# EAGLE design ESP01 Breakout (EAGLE 6.5.0)
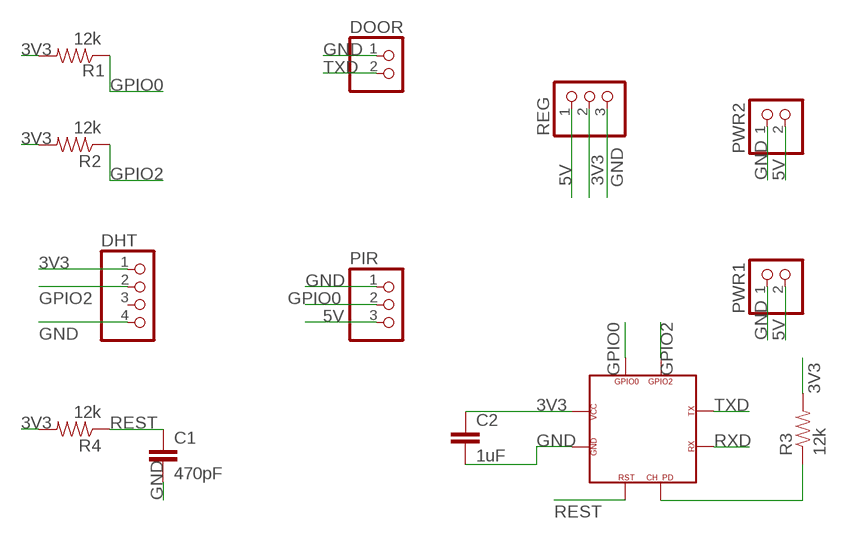
[diagram p0: schematic, sheet 1]

## Parts
C1  470pF  CAPEZ  [CAP-PTH-SMALLEZ]
C2  1uF  CAPEZ  [CAP-PTH-SMALLEZ]
DHT  PINHD-1X4  [1X04]
DOOR  PINHD-1X2/90  [1X02/90]
PIR  PINHD-1X3  [1X03]
PWR1  PINHD-1X2/90  [1X02/90]
PWR2  PINHD-1X2/90  [1X02/90]
R1  12k  RESISTORPTH-1/4W  [AXIAL-0.4]
R2  12k  RESISTORPTH-1/4W  [AXIAL-0.4]
R3  12k  RESISTORPTH-1/4W  [AXIAL-0.4]
R4  12k  RESISTORPTH-1/4W  [AXIAL-0.4]
REG  PINHD-1X3  [1X03]
U$2  ESP-01  [ESP-01]

## Nets
3V3: C2.1 DHT.1 R1.P$2 R2.P$2 R3.P$2 R4.P$2 REG.2 U$2.VCC
5V: PIR.3 PWR1.2 PWR2.2 REG.1
GND: C1.2 C2.2 DHT.4 DOOR.1 PIR.1 PWR1.1 PWR2.1 REG.3 U$2.GND
GPIO0: PIR.2 R1.P$1 U$2.GPIO0
GPIO2: DHT.2 R2.P$1 U$2.GPIO2
N$3: R3.P$1 U$2.CH_PD(CP_PD)
REST: C1.1 R4.P$1 U$2.RST
RXD: U$2.RXD(RX)
TXD: DOOR.2 U$2.TXD(TX)
Unconnected: DHT.3

## Library data of the parts
C1 C2 = SparkFun-Capacitors:CAP: Capacitor Standard 0603 ceramic capacitor, and 0.1" leaded capacitor.
DHT = pinhead:PINHD-1X4: PIN HEADER
DOOR PWR1 PWR2 = pinhead:PINHD-1X2: PIN HEADER
PIR REG = pinhead:PINHD-1X3: PIN HEADER
R1-R4 = SparkFun-Passives:RESISTOR: Resistor Basic schematic elements and footprints for 0603, 1206, and PTH resistors.
U$2 = Franc:ESP-01

## Board
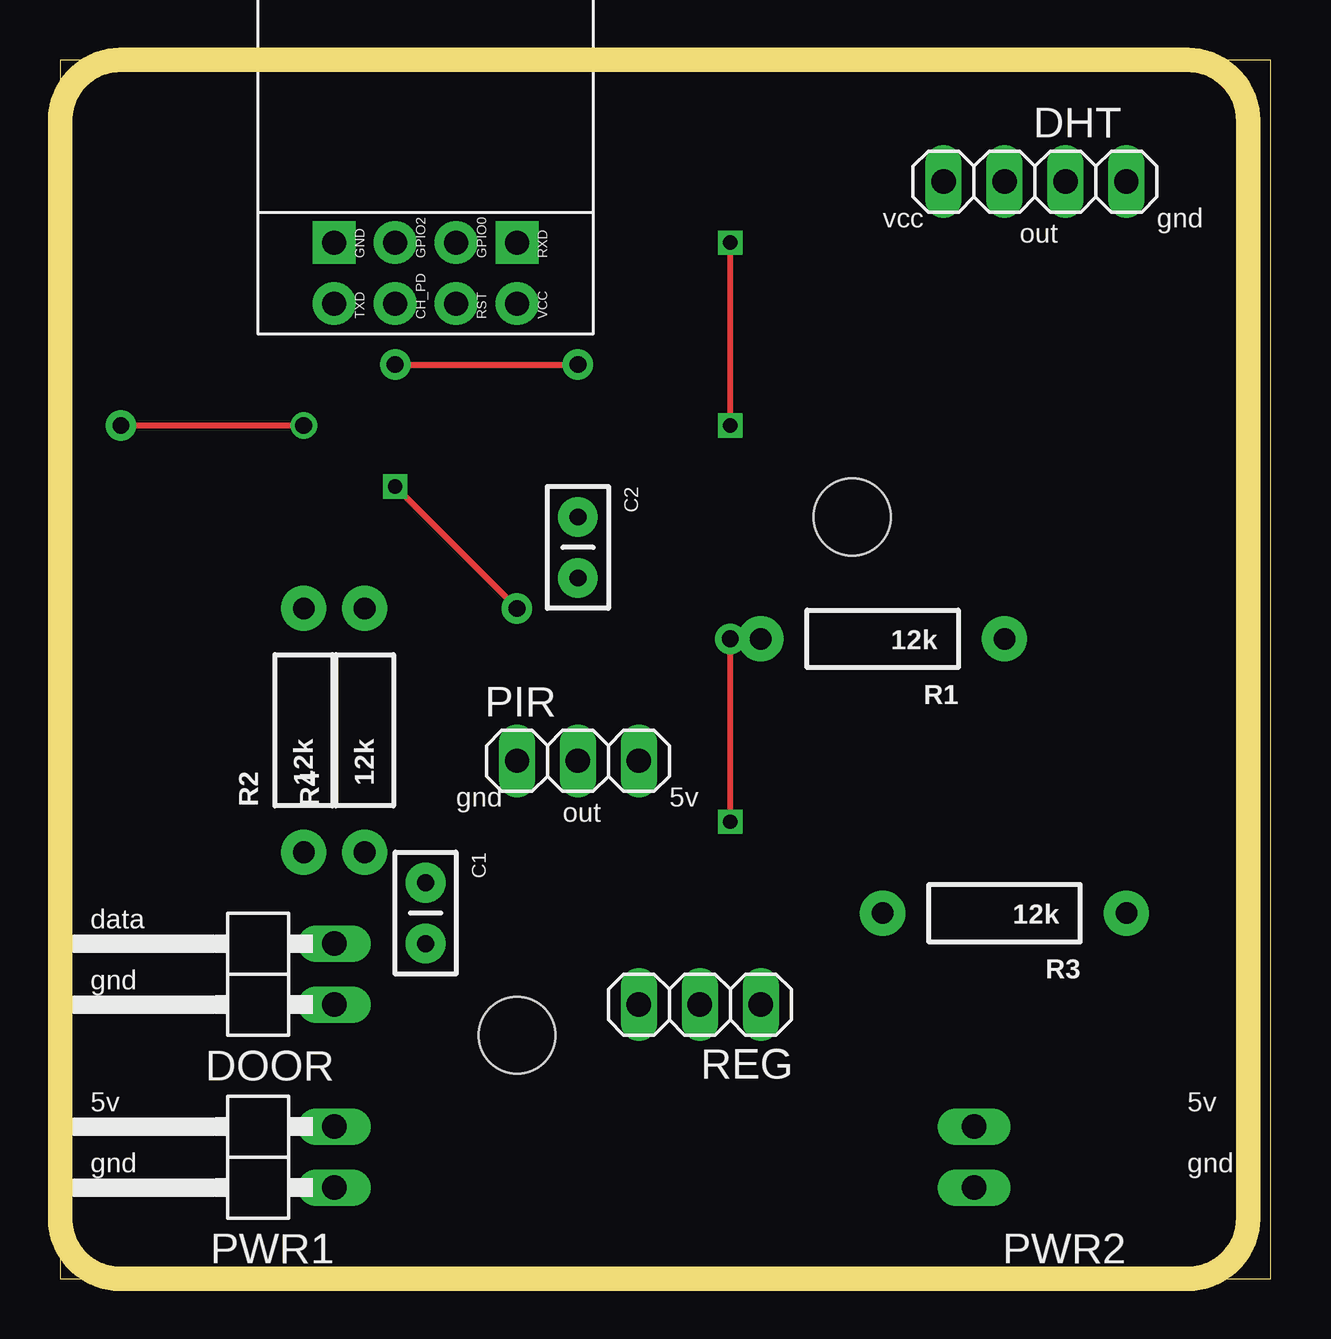
[diagram p1: board, top side]
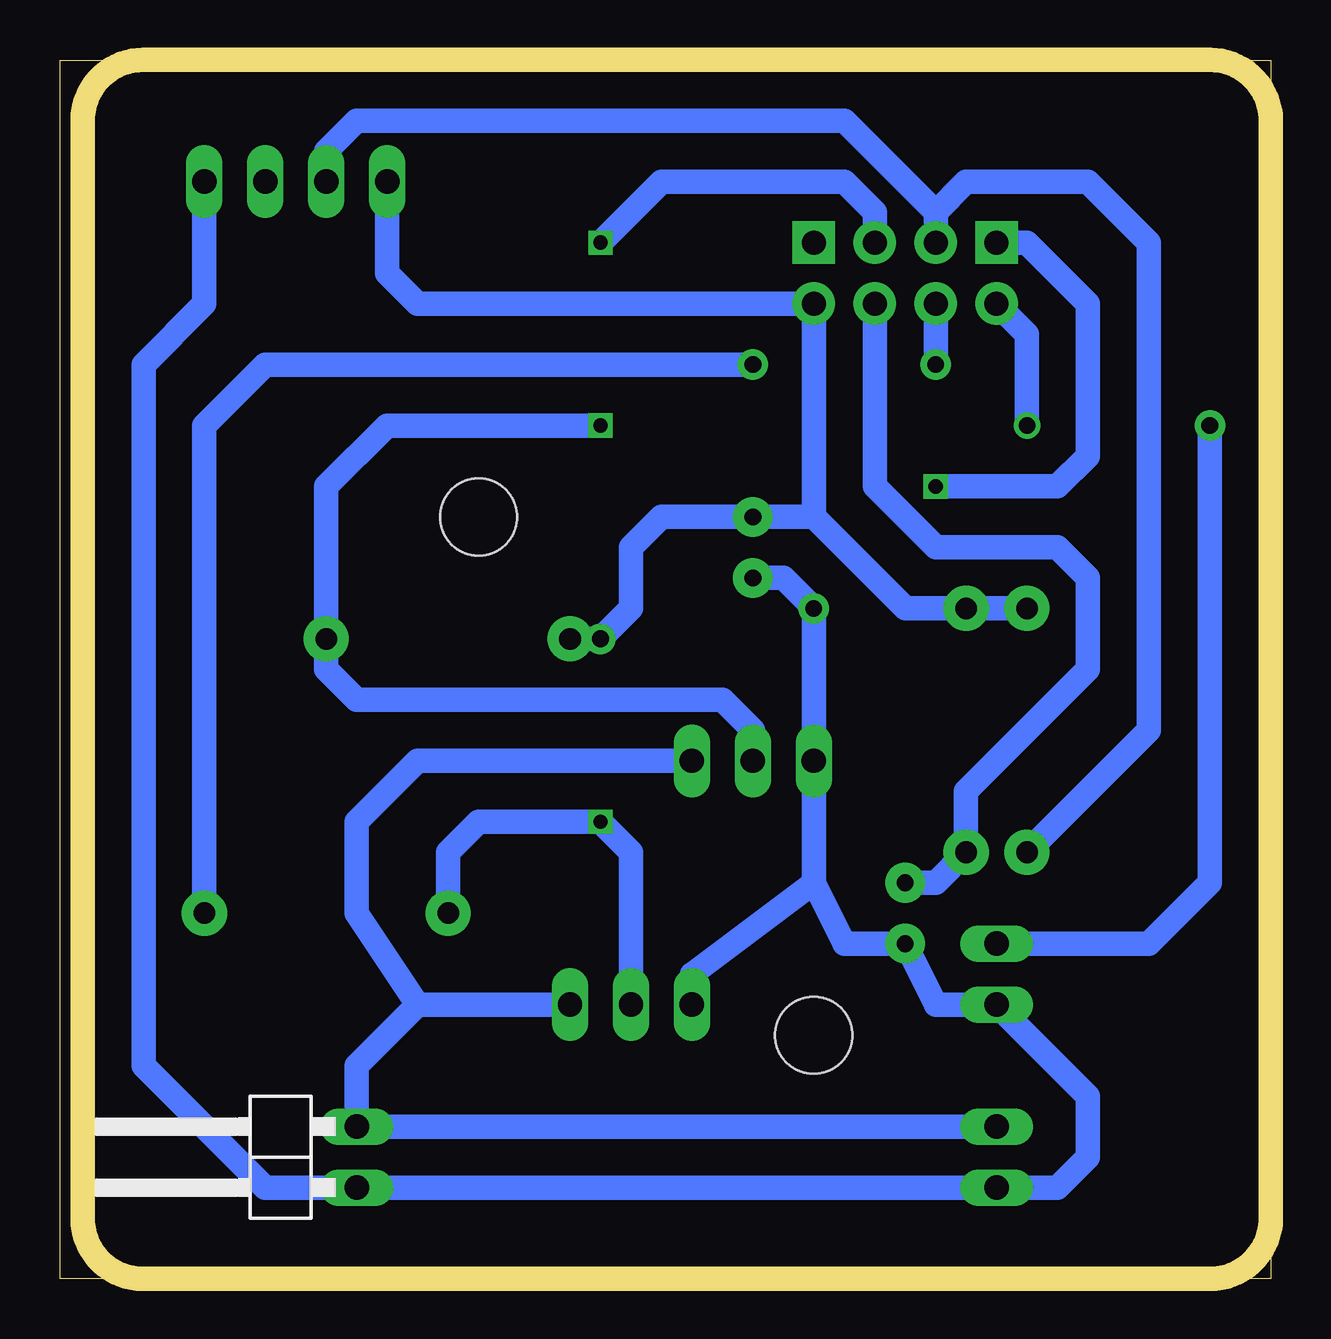
[diagram p2: board, bottom side, seen from below]

Size 50.47 x 50.79 mm. Coordinates in mm from the lower left corner, seen from the top.
Outline: 0,0 50.47,0 50.47,50.79 0,50.79 0,0
Copper layers (1*16): Top 0.035mm / dielectric 1.5mm / Bottom 0.035mm
Design rules "default": minimum track width 10mil, minimum drill 24mil, track to track 8mil, track to pad 8mil, pad to pad 8mil, via to via 8mil, smd to smd 8mil, copper to edge 40mil, drill to drill 8mil, minimum pad ring 10mil, minimum via ring 8mil, stop-mask expansion 4mil, vias tented up to drill 0mil, thermal gap 10mil
Holes 3.2 mm at 19.05,10.16 33.02,31.75
Milling: 8 lines

### Footprints (pad centres in the part's own frame; a part is rotated, then mirrored left to right if it is on the bottom)
CAP-PTH-SMALLEZ = drill 0.7 pad 1.651: 1 0,0; 2 2.54,0
1X04 = drill 1.016 long: 1 -3.81,0; 2 -1.27,0; 3 1.27,0; 4 3.81,0
1X02/90 = drill 1.016 long: 1 -1.27,-3.81; 2 1.27,-3.81
1X03 = drill 1.016 long: 1 -2.54,0; 2 0,0; 3 2.54,0
AXIAL-0.4 = drill 0.9 pad 1.88: P$1 -5.08,0; P$2 5.08,0
ESP-01 = drill 1 pad 1.778: CH_PD -1.27,1.27; GPIO0 1.27,-1.27; GPIO2 1.27,1.27; RST -1.27,-1.27; TXD -1.27,3.81; VCC -1.27,-3.81 | drill 1 pad 1.778 square: GND 1.27,3.81; RXD 1.27,-3.81

### Placement (x,y rotation side)
C1  15.24,16.51 270 top
C2  21.59,31.75 270 top
DHT  40.64,45.72 0 top
DOOR  7.62,12.7 90 top
PIR  21.59,21.59 0 top
PWR1  7.62,5.08 90 top
PWR2  41.91,5.08 90 bottom
R1  34.29,26.67 180 top
R2  10.16,22.86 90 top
R3  39.37,15.24 180 top
R4  12.7,22.86 90 top
REG  26.67,11.43 180 top
U$2  15.24,41.91 90 top

### Tracks (layer width: path | path; a pad name or v marks a point on that pad's centre or on a via)
3V3  (via drill 0.6, 0.7 pad 1.27)
  Top 0.254: v27.94,19.05 v27.94,26.67
  Bottom 1.016: REG.2 26.67,17.78 v27.94,19.05 33.02,19.05 34.29,17.78 R3.P$2 | R4.P$2 R2.P$2 15.24,27.94 19.05,31.75 | DHT.1 36.83,41.91 35.56,40.64 U$2.VCC 19.05,31.75 | R1.P$2 v27.94,26.67 26.67,27.94 26.67,30.48 25.4,31.75 C2.1 19.05,31.75
5V
  Bottom 1.016: PWR1.2 PWR2.2 38.1,8.89 35.56,11.43 | 35.56,11.43 REG.1 | PIR.3 35.56,21.59 38.1,19.05 38.1,15.24 35.56,11.43
GND  (via drill 0.6, 0.7 pad 1.27)
  Top 0.254: v13.97,33.02 v19.05,27.94
  Bottom 1.016: U$2.GND 10.16,43.18 7.62,40.64 7.62,34.29 8.89,33.02 v13.97,33.02 | DHT.4 44.45,40.64 46.99,38.1 46.99,8.89 41.91,3.81 PWR2.1 PWR1.1 8.89,3.81 7.62,5.08 7.62,7.62 DOOR.1 13.97,11.43 C1.2 17.78,13.97 19.05,16.51 | 19.05,16.51 PIR.1 v19.05,27.94 20.32,29.21 C2.2 | 19.05,16.51 24.13,12.7 REG.3
GPIO0  (via drill 0.6)
  Top 0.254: v27.94,35.56 v27.94,43.18
  Bottom 1.016: U$2.GPIO0 16.51,44.45 17.78,45.72 25.4,45.72 v27.94,43.18 | PIR.2 21.59,22.86 22.86,24.13 38.1,24.13 39.37,25.4 R1.P$1 39.37,33.02 36.83,35.56 v27.94,35.56
GPIO2
  Bottom 1.016: U$2.GPIO2 13.97,44.45 | 13.97,44.45 12.7,45.72 7.62,45.72 5.08,43.18 5.08,22.86 R2.P$1 | 13.97,44.45 17.78,48.26 38.1,48.26 39.37,46.99 DHT.2
N$3  (via drill 0.7 pad 1.27)
  Top 0.254: v13.97,38.1 v21.59,38.1
  Bottom 1.016: U$2.CH_PD v13.97,38.1 | v21.59,38.1 41.91,38.1 44.45,35.56 R3.P$1
REST
  Bottom 1.016: U$2.RST 16.51,33.02 13.97,30.48 8.89,30.48 7.62,29.21 7.62,25.4 12.7,20.32 R4.P$1 13.97,16.51 C1.1
TXD  (via drill 0.7, 0.7 pad 1.27)
  Top 0.254: v10.16,35.56 v2.54,35.56
  Bottom 1.016: DOOR.2 5.08,13.97 2.54,16.51 v2.54,35.56 | v10.16,35.56 10.16,39.37 U$2.TXD

### Text on the board
tNames: vcc | gnd | out | gnd | 5v | out | data | gnd | 5v | 5v | gnd | gnd